# EAGLE design 3_RS232 (EAGLE 7.7.0)
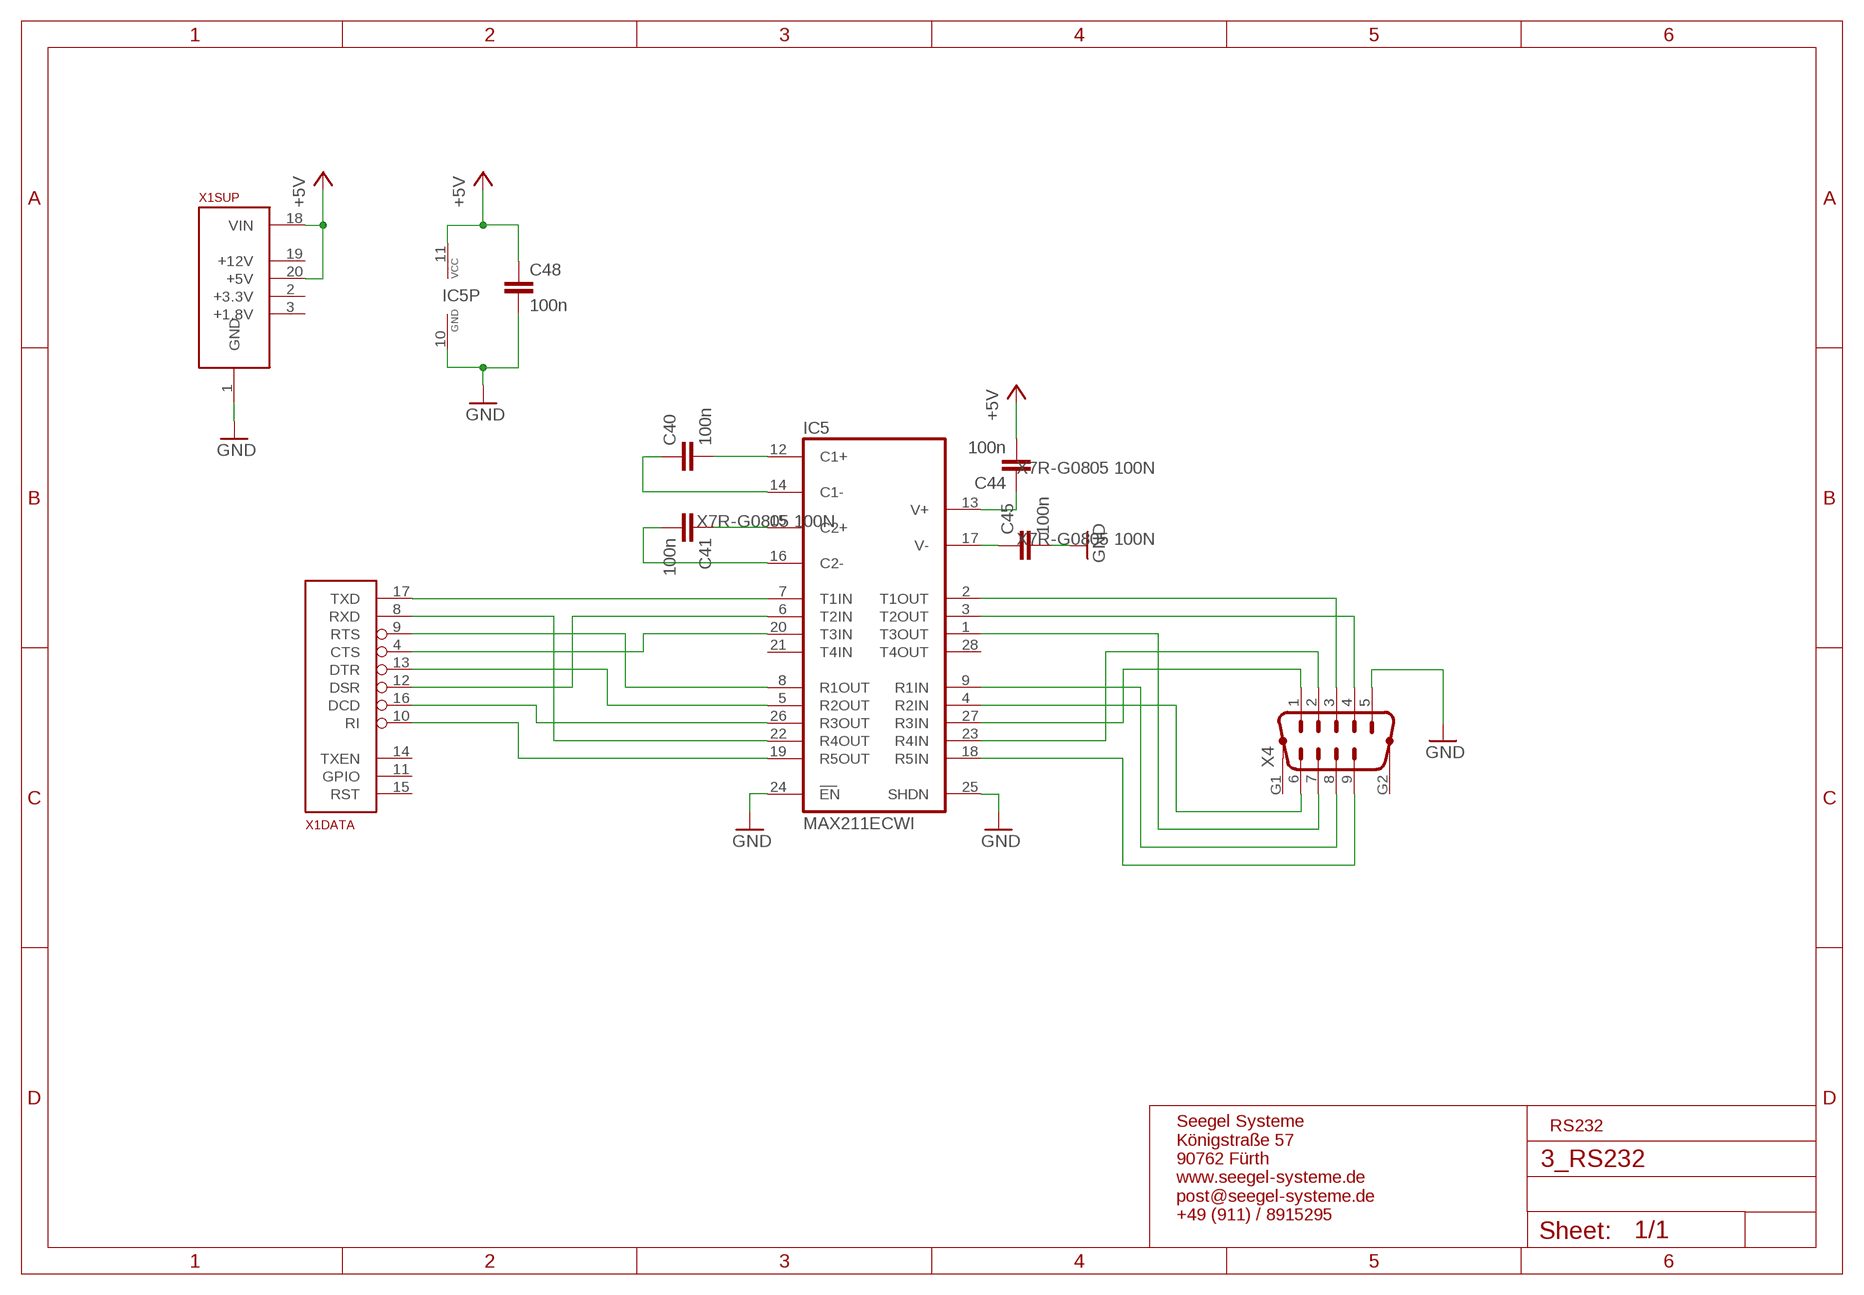
[diagram p0: schematic, sheet 1]

## Parts
C40  100n  C-EUC0805  [C0805]
C41  100n  C-EUC0805  [C0805]
C44  100n  C-EUC0805  [C0805]
C45  100n  C-EUC0805  [C0805]
C48  100n  C-EUC0805  [C0805]
IC5  MAX211ECWI  [SO28L]
X1  ALLSERIALSLAVE  [DAUGHTER-THT]
X4  M09HP  [M09HP]

## Nets
+5V: C44.2 C48.1 IC5.11(VCC) X1.18(SUP:VIN) X1.20(SUP:+5V)
GND: C45.2 C48.2 IC5.10(GND) IC5.24(EN) IC5.25(SHDN) X1.1(SUP:GND) X4.5
N$9: IC5.18(R5IN) X4.9
N$12: IC5.9(R1IN) X4.8
N$15: IC5.1(T3OUT) X4.7
N$16: IC5.4(R2IN) X4.6
N$17: IC5.27(R3IN) X4.1
N$18: IC5.23(R4IN) X4.2
N$23: IC5.2(T1OUT) X4.3
N$24: IC5.3(T2OUT) X4.4
N$25: C40.2 IC5.12(C1+)
N$26: C40.1 IC5.14(C1-)
N$27: C41.1 IC5.15(C2+)
N$30: C45.1 IC5.17(V-)
N$31: C44.1 IC5.13(V+)
N$92: C41.2 IC5.16(C2-)
N$93: IC5.7(T1IN) X1.17(DATA:TXD)
N$94: IC5.22(R4OUT) X1.8(DATA:RXD)
N$95: IC5.20(T3IN) X1.4(DATA:CTS)
N$96: IC5.8(R1OUT) X1.9(DATA:RTS)
N$97: IC5.26(R3OUT) X1.16(DATA:DCD)
N$98: IC5.19(R5OUT) X1.10(DATA:RI)
N$99: IC5.5(R2OUT) X1.13(DATA:DTR)
N$100: IC5.6(T2IN) X1.12(DATA:DSR)
Unconnected: IC5.21(T4IN) IC5.28(T4OUT) X1.2(SUP:+3.3V) X1.3(SUP:+1.8V) X1.5(USB:D-) X1.6(USB:D+) X1.7(USB:VUSB) X1.11(DATA:GPIO) X1.14(DATA:TXEN) X1.15(DATA:RST) X1.19(SUP:+12V) X4.G1 X4.G2

## Notes on the sheet
- RS232
- Seegel Systeme
  Königstraße 57
  90762 Fürth
  www.seegel-systeme.de
  post@seegel-systeme.de
  +49 (911) / 8915295

## Library data of the parts
C40 C41 C44 C45 C48 = rcl:C-EU: CAPACITOR, European symbol; OC_REICHELT: X7R-G0805 100N
IC5 = maxim:MAX211ECWI: RS232 TRANSCEIVER; MPN: MAX211ECWI+T; OC_FARNELL: 2519263; OC_NEWARK: 67K4400
X1 = AllSerialv2:ALLSERIALSLAVE
X4 = con-subd:M09HP: SUB-D; OC_FARNELL: unknown; OC_NEWARK: unknown; OC_REICHELT: D-SUB ST 09EU

## Board
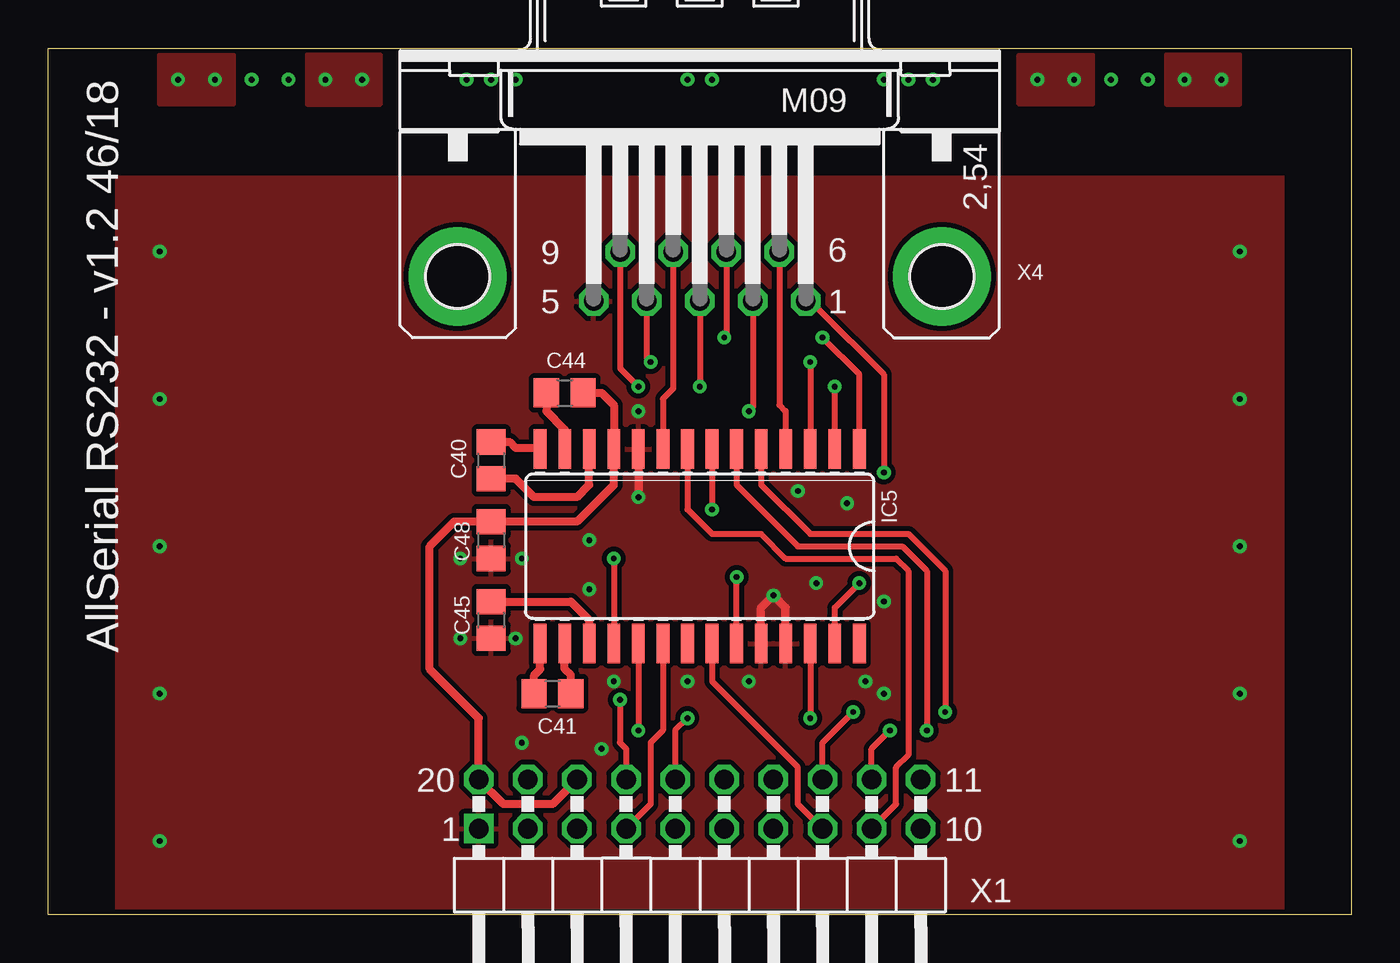
[diagram p1: board, top side]
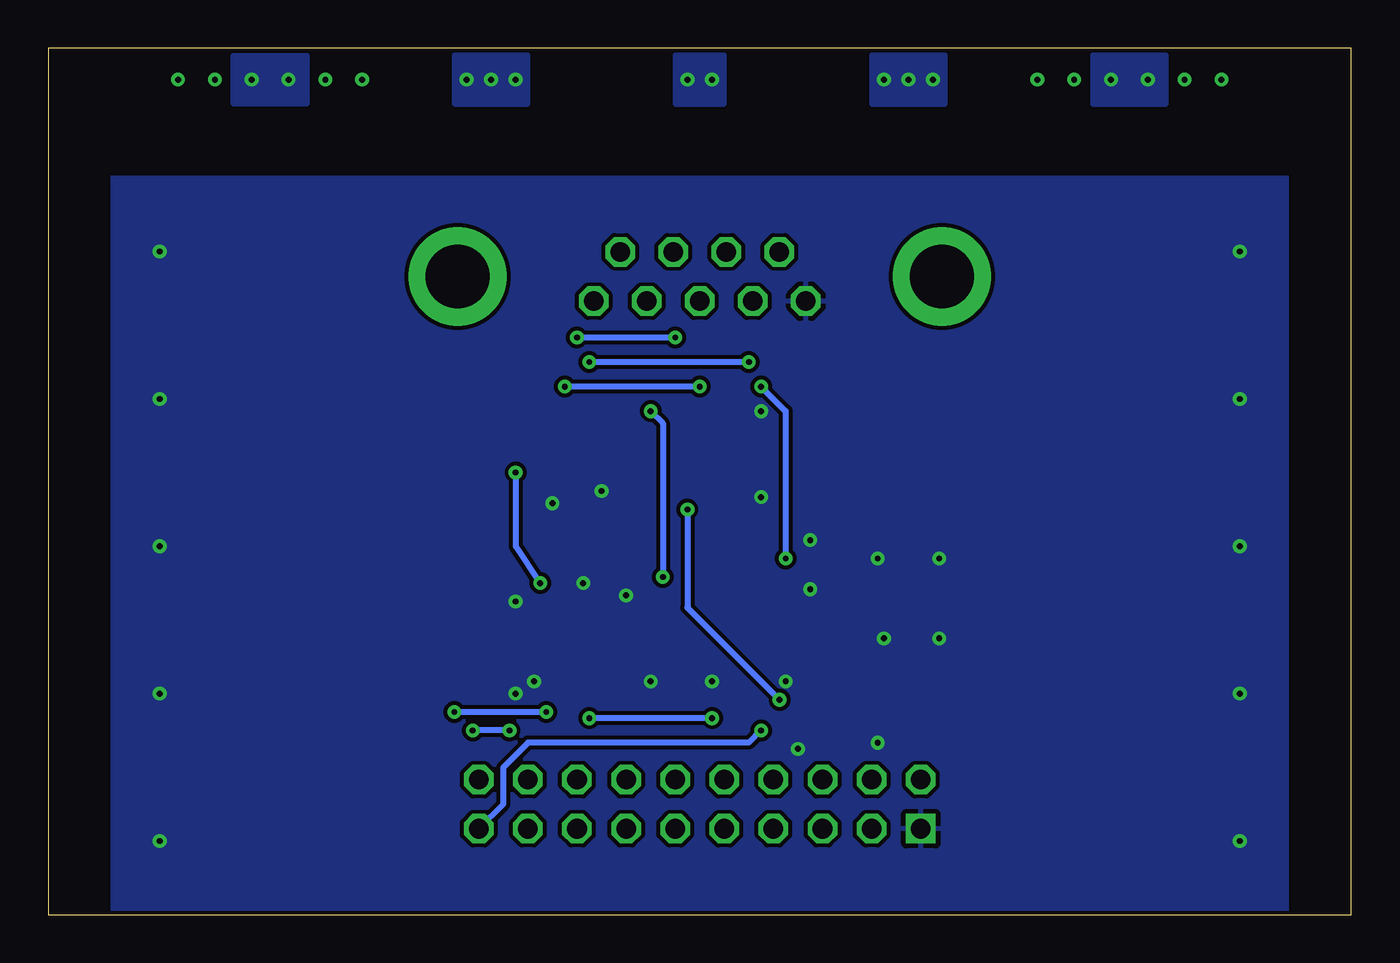
[diagram p2: board, bottom side, seen from below]

Size 67.4 x 44.8 mm. Coordinates in mm from the lower left corner, seen from the top.
Copper layers (1*16): Top 0.035mm / dielectric 1.5mm / Bottom 0.035mm
Design rules "default *": minimum track width 10mil, minimum drill 0.3mm, track to track 8mil, track to pad 8mil, pad to pad 8mil, via to via 8mil, smd to smd 8mil, copper to edge 0.2mm, drill to drill 8mil, minimum pad ring 10mil, minimum via ring 8mil, stop-mask expansion 4mil, vias tented up to drill 0.3mm, thermal gap 10mil

### Footprints (pad centres in the part's own frame; a part is rotated, then mirrored left to right if it is on the bottom)
C0805 = smd 1.3 x 1.5: 1 -0.95,0; 2 0.95,0
SO28L = smd 0.66 x 2.032: 1 -8.255,-5.029; 2 -6.985,-5.029; 3 -5.715,-5.029; 4 -4.445,-5.029; 5 -3.175,-5.029; 6 -1.905,-5.029; 7 -0.635,-5.029; 8 0.635,-5.029; 9 1.905,-5.029; 10 3.175,-5.029; 11 4.445,-5.029; 12 5.715,-5.029; 13 6.985,-5.029; 14 8.255,-5.029; 15 8.255,5.029; 16 6.985,5.029; 17 5.715,5.029; 18 4.445,5.029; 19 3.175,5.029; 20 1.905,5.029; 21 0.635,5.029; 22 -0.635,5.029; 23 -1.905,5.029; 24 -3.175,5.029; 25 -4.445,5.029; 26 -5.715,5.029; 27 -6.985,5.029; 28 -8.255,5.029
DAUGHTER-THT = drill 1.016 square: 1 -11.43,4.445 | drill 1.016 octagon: 2 -8.89,4.445; 3 -6.35,4.445; 4 -3.81,4.445; 5 -1.27,4.445; 6 1.27,4.445; 7 3.81,4.445; 8 6.35,4.445; 9 8.89,4.445; 10 11.43,4.445; 11 11.43,6.985; 12 8.89,6.985; 13 6.35,6.985; 14 3.81,6.985; 15 1.27,6.985; 16 -1.27,6.985; 17 -3.81,6.985; 18 -6.35,6.985; 19 -8.89,6.985; 20 -11.43,6.985
M09HP = drill 1.016 octagon: 1 -5.486,1.27; 2 -2.743,1.27; 3 0,1.27; 4 2.743,1.27; 5 5.486,1.27; 6 -4.115,-1.27; 7 -1.372,-1.27; 8 1.372,-1.27; 9 4.115,-1.27 | drill 3.302 pad 5.08: G1 -12.522,0; G2 12.522,0

### Placement (x,y rotation side)
C40  22.91,23.5 270 top
C41  26.08,11.43 0 top
C44  26.72,26.99 0 top
C45  22.91,15.24 270 top
C48  22.91,19.37 270 top
IC5  33.7,19.05 180 top
X1  33.7,0 0 top
X4  33.7,33 180 top

### Tracks (layer width: path | path; a pad name or v marks a point on that pad's centre or on a via)
+5V
  Top 0.406: C44.2 28.62,26.99 29.26,26.35 IC5.11 29.26,22.23 27.35,20.32 C48.1 | X1.18 26.08,5.71 23.54,5.71 X1.20 22.27,10.16 19.73,12.7 19.73,19.05 21,20.32 C48.1 | C48.1
GND  (via drill 0.3)
  Top 0.406: IC5.10 v30.53,21.59 | IC5.24 36.88,15.88 v37.51,16.51 38.15,15.88 IC5.25
  other vias: 5.76,34.29 5.76,26.67 5.76,19.05 5.76,11.43 5.76,3.81 33.07,12.06 36.24,12.06 28.62,8.57 29.26,12.06 24.49,8.89 43.23,16.19 43.23,11.43 42.27,12.06 61.64,34.29 61.64,26.67 61.64,19.05 61.64,11.43 61.64,3.81 21.32,18.41 24.49,18.41 21.32,14.29 24.18,14.29 27.99,19.37 27.99,16.83 39.73,17.14 38.78,21.91 41.32,21.27 30.53,26.04
  pour Bottom: -0.59,0 67.99,0 67.99,38.1 -0.59,38.1
  pour Top (isolate 0.254): -0.59,38.1 67.99,38.1 67.99,0 -0.59,0
N$1  (via drill 0.3)
  other vias: 14.33,43.18 16.24,43.18
  pour Top: 17.19,44.45 13.38,44.45 13.38,41.91 17.19,41.91
N$2  (via drill 0.3)
  other vias: 6.71,43.18 8.62,43.18
  pour Top: 5.76,44.45 9.57,44.45 9.57,41.91 5.76,41.91
N$3  (via drill 0.3)
  other vias: 58.78,43.18 60.69,43.18
  pour Top: 61.64,44.45 57.83,44.45 57.83,41.91 61.64,41.91
N$4  (via drill 0.3)
  other vias: 51.16,43.18 53.07,43.18
  pour Top: 50.21,44.45 54.02,44.45 54.02,41.91 50.21,41.91
N$5  (via drill 0.3)
  other vias: 33.07,43.18 34.34,43.18
  pour Bottom: 32.43,44.45 34.97,44.45 34.97,41.91 32.43,41.91
N$6  (via drill 0.3)
  other vias: 10.52,43.18 12.43,43.18
  pour Bottom: 9.57,44.45 13.38,44.45 13.38,41.91 9.57,41.91
N$7  (via drill 0.3)
  other vias: 54.97,43.18 56.88,43.18
  pour Bottom: 54.02,41.91 57.83,41.91 57.83,44.45 54.02,44.45
N$8  (via drill 0.3)
  other vias: 22.91,43.18 21.64,43.18 24.18,43.18
  pour Bottom: 21,44.45 24.81,44.45 24.81,41.91 21,41.91
N$9  (via drill 0.3)
  Top 0.305: X4.9 29.59,28.25 v30.53,27.3 | v29.26,18.41 IC5.18
  Bottom 0.305: v30.53,27.3 29.26,26.04 v29.26,18.41
N$10  (via drill 0.3)
  other vias: 44.5,43.18 43.23,43.18 45.77,43.18
  pour Bottom: 46.4,41.91 42.59,41.91 42.59,44.45 46.4,44.45
N$12
  Top 0.305: X4.8 32.33,27.2 31.8,26.67 IC5.9
N$15  (via drill 0.3)
  Top 0.305: X4.7 35.07,29.95 v34.97,29.84 | IC5.1 41.96,27.94 v40.05,29.84
  Bottom 0.305: v34.97,29.84 v40.05,29.84
N$16
  Top 0.305: X4.6 37.82,26.36 38.15,26.04 IC5.4
N$17  (via drill 0.3)
  Top 0.305: X4.1 39.83,31.34 43.23,27.94 v43.23,22.86 | IC5.27 40.69,15.88 v41.96,17.14
  Bottom 0.305: v43.23,22.86 43.23,19.05 v41.96,17.14
N$18  (via drill 0.3)
  Top 0.305: X4.2 36.44,26.24 v36.24,26.04 | IC5.23 v35.61,17.46
  Bottom 0.305: v36.24,26.04 35.61,25.4 v35.61,17.46
N$23  (via drill 0.3)
  Top 0.305: X4.3 v33.7,27.3 | IC5.2 v40.69,27.3
  Bottom 0.305: v33.7,27.3 v40.69,27.3
N$24  (via drill 0.3)
  Top 0.305: X4.4 30.96,28.78 v31.16,28.57 | v39.42,28.57 IC5.3
  Bottom 0.305: v31.16,28.57 v39.42,28.57
N$25
  Top 0.406: IC5.12 27.99,22.23 27.35,21.59 25.13,21.59 24.18,22.54 C40.2
N$26
  Top 0.305: IC5.14 25.39,24.13
  Top 0.406: 25.39,24.13 24.18,24.13 23.86,24.45 C40.1
N$27
  Top 0.406: C41.1 25.13,12.38 25.45,12.7 IC5.15
N$30
  Top 0.406: C45.1 27.04,16.19 27.99,15.24 IC5.17
N$31
  Top 0.406: IC5.13 26.72,25.08 25.77,26.03 C44.1
N$92
  Top 0.406: IC5.16 26.72,12.7 27.03,12.38 C41.2
N$93  (via drill 0.3)
  Top 0.305: IC5.7 v34.34,20.95 | v29.57,11.11 29.57,8.89 29.89,8.57 X1.17
  Bottom 0.305: v34.34,20.95 34.34,15.88 v29.57,11.11
N$94
  Top 0.305: IC5.22 34.34,12.06 38.78,7.62 38.78,5.71 X1.8
N$95
  Top 0.305: IC5.20 31.8,9.53 31.16,8.89 31.16,5.71 X1.4
N$96
  Top 0.305: IC5.8 33.07,20.95 34.34,19.68 36.88,19.68 38.15,18.41 43.86,18.41 44.5,17.78 44.5,8.26 43.86,7.62 43.86,5.71 X1.9
N$97  (via drill 0.3)
  Top 0.305: v33.07,10.16 32.43,9.53 X1.16 | IC5.26 v39.42,10.16
  Bottom 0.305: v33.07,10.16 v39.42,10.16
N$98  (via drill 0.3)
  Top 0.305: IC5.19 v30.53,9.53
  Bottom 0.305: v30.53,9.53 31.16,8.89 42.59,8.89 43.86,7.62 43.86,5.71 X1.10
N$99  (via drill 0.3)
  Top 0.305: IC5.5 36.88,22.23 39.42,19.68 44.5,19.68 46.4,17.78 v46.4,10.48 | X1.13 40.05,8.89 v41.64,10.48
  Bottom 0.305: v41.64,10.48 v46.4,10.48
N$100  (via drill 0.3)
  Top 0.305: IC5.6 35.61,22.23 38.78,19.05 44.18,19.05 45.45,17.78 v45.45,9.53 | X1.12 42.59,8.57 v43.54,9.53
  Bottom 0.305: v43.54,9.53 v45.45,9.53

### Text on the board
tPlace: AllSerial RS232 - v1.2 46/18